# Altium schematic sheet BMS_Monitor.SchDoc
size A0; SheetNumber: 1; SheetTotal: 1
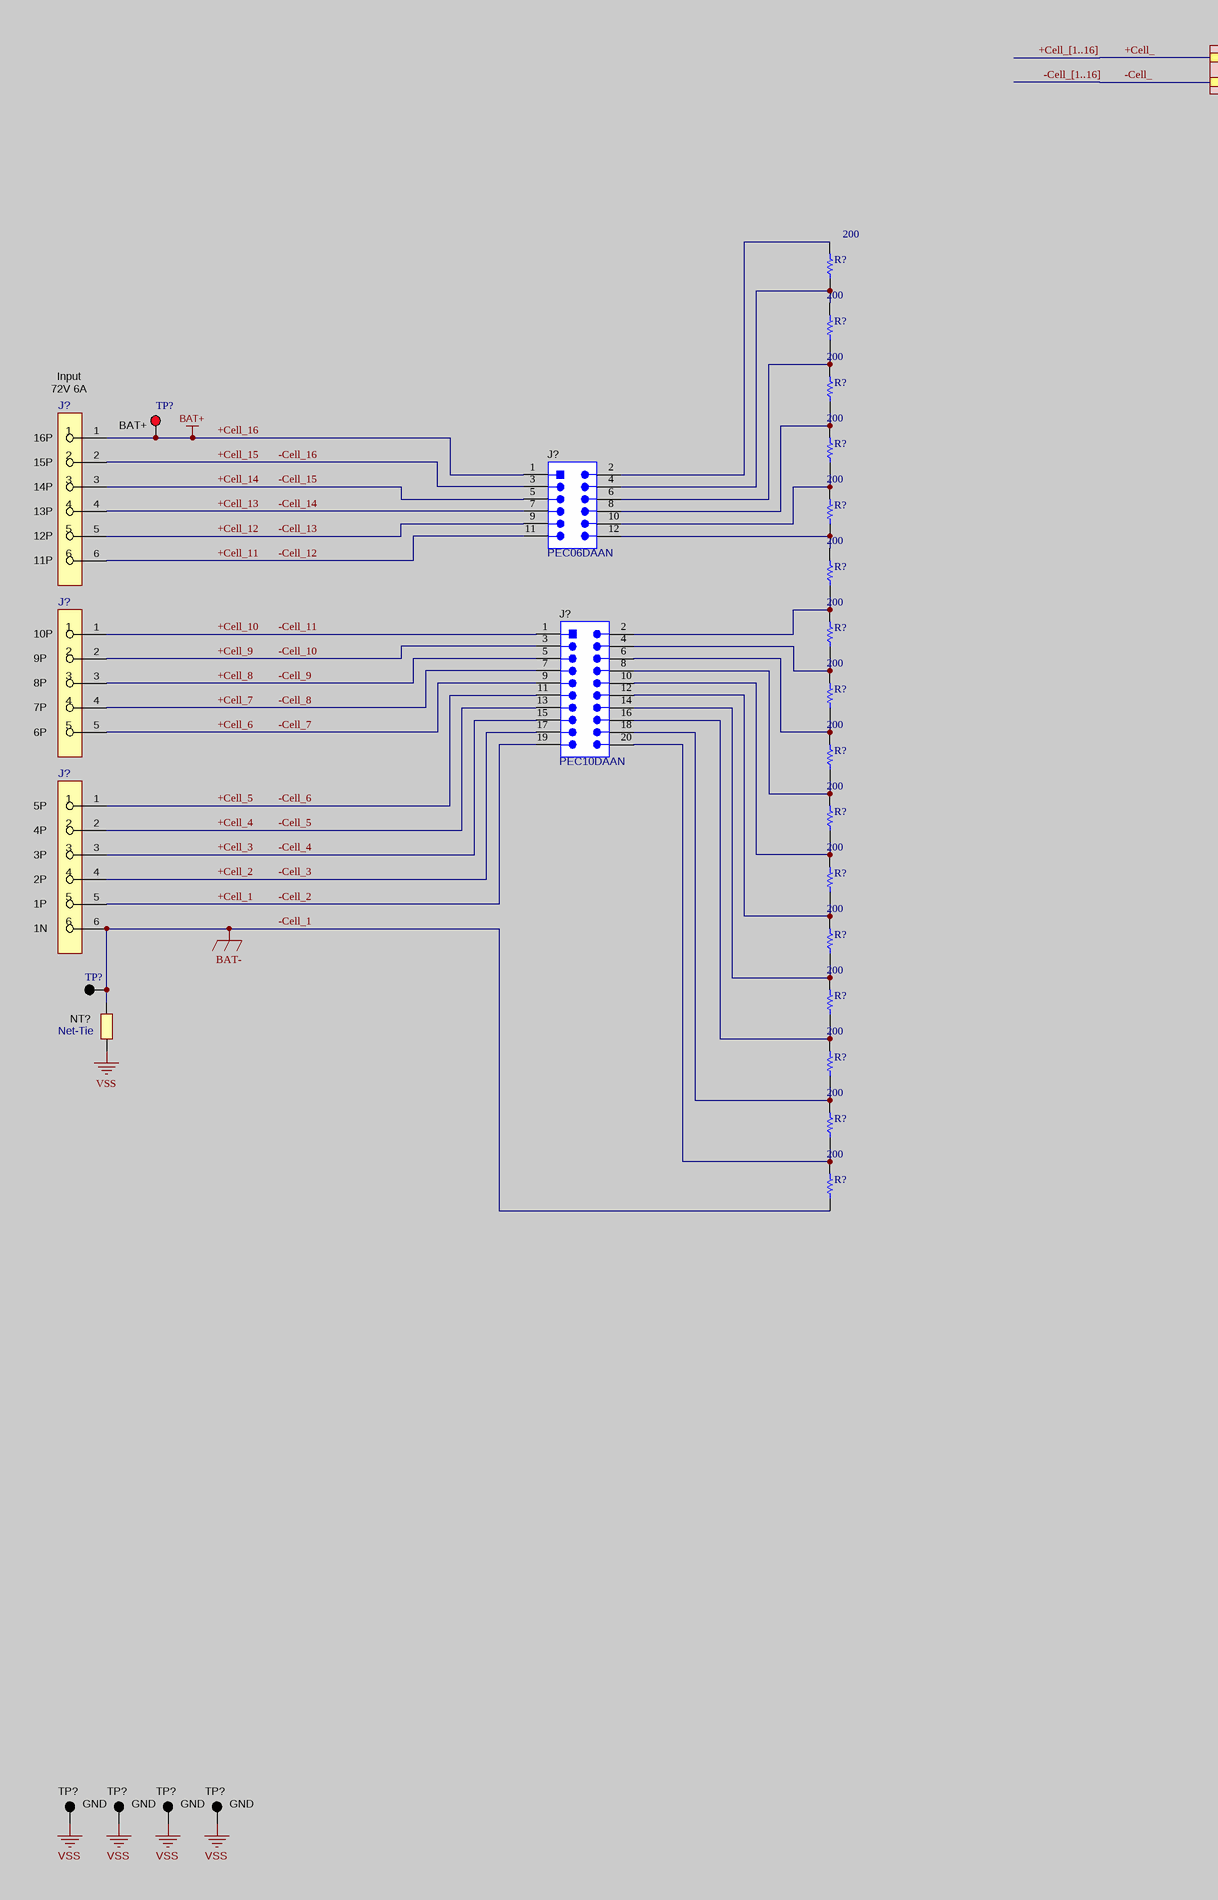
[diagram p0: BMS_Monitor.SchDoc, left]
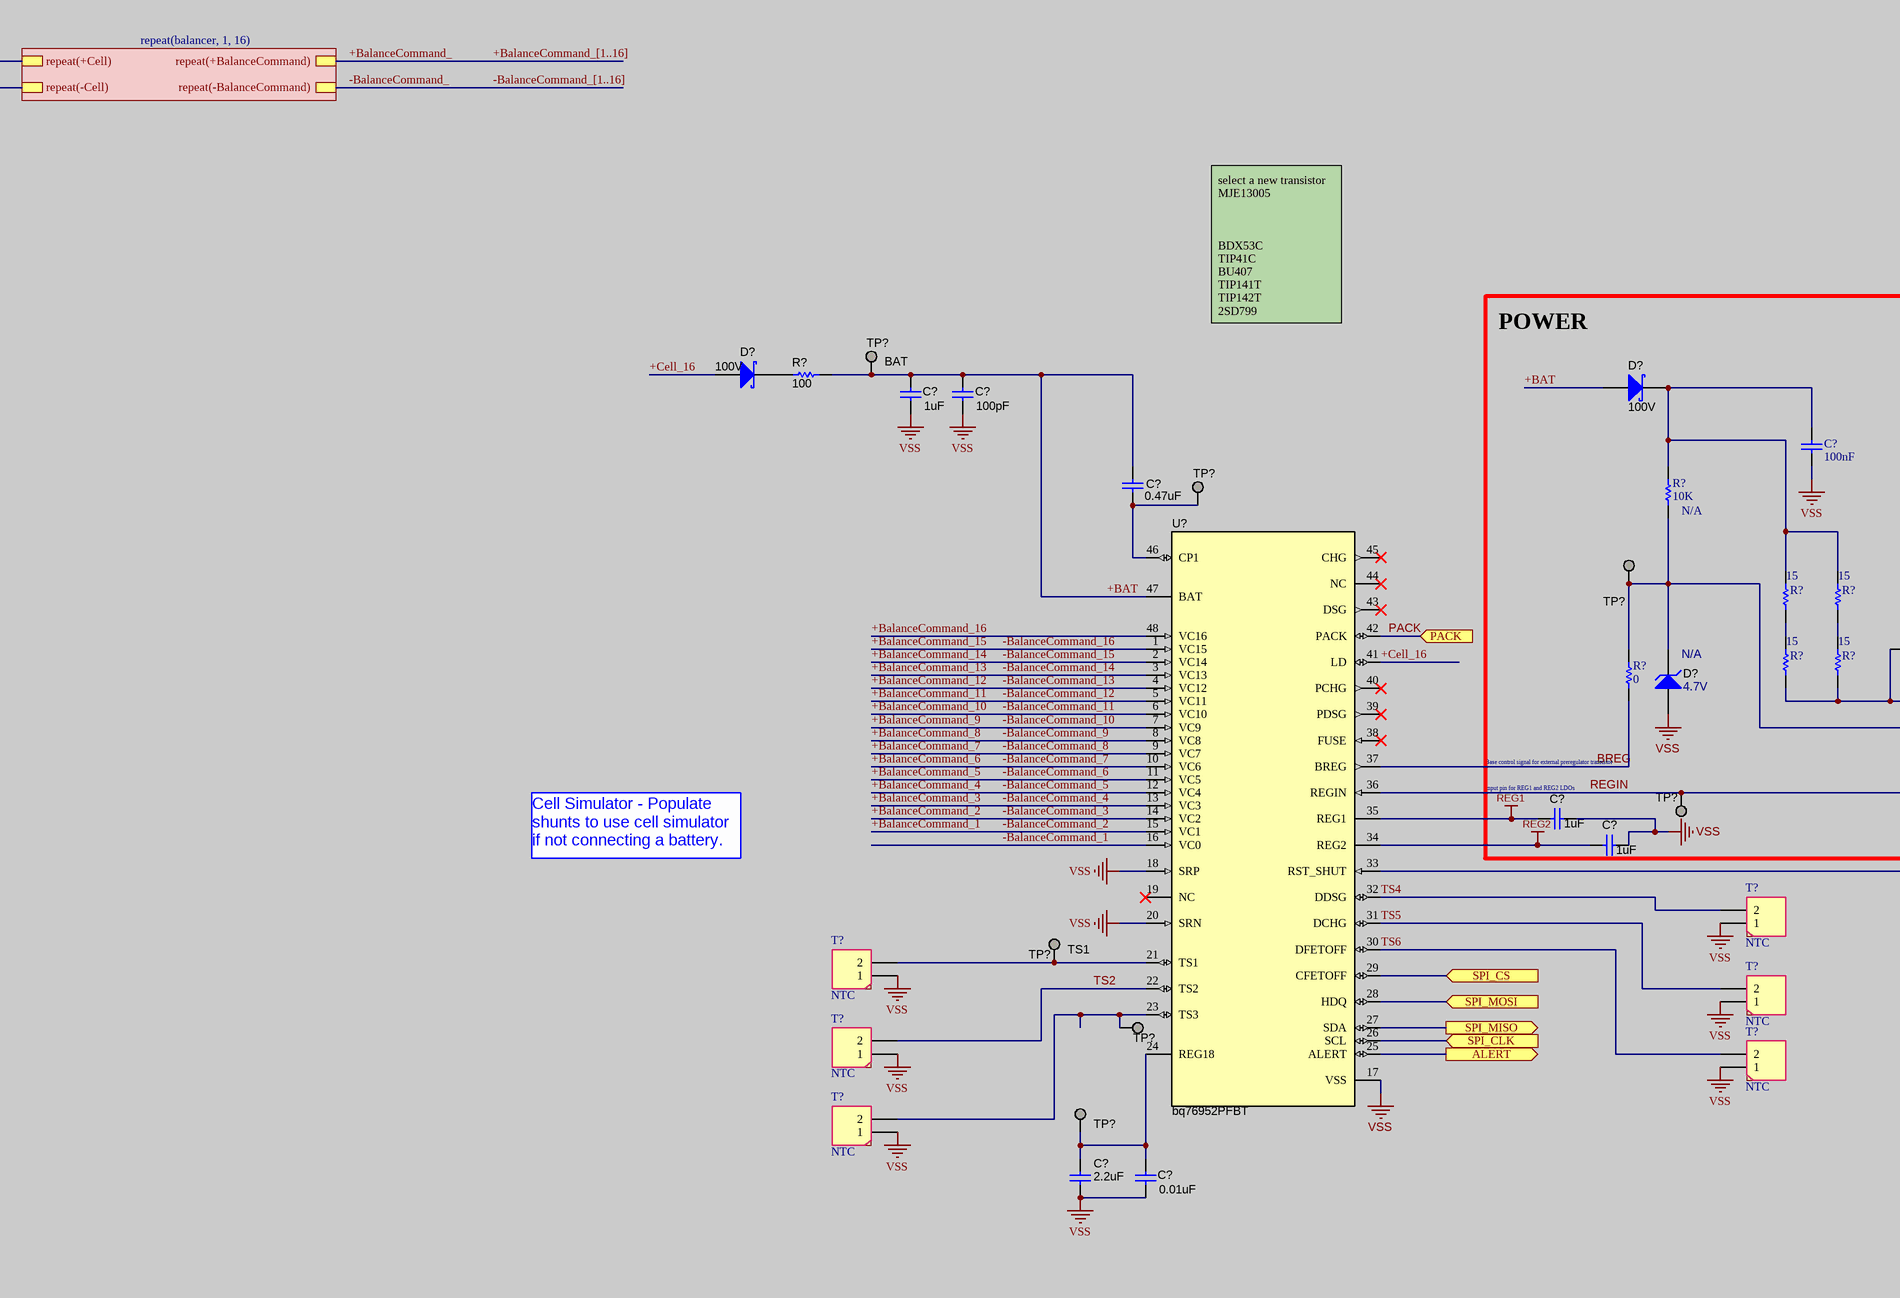
[diagram p1: BMS_Monitor.SchDoc, middle]
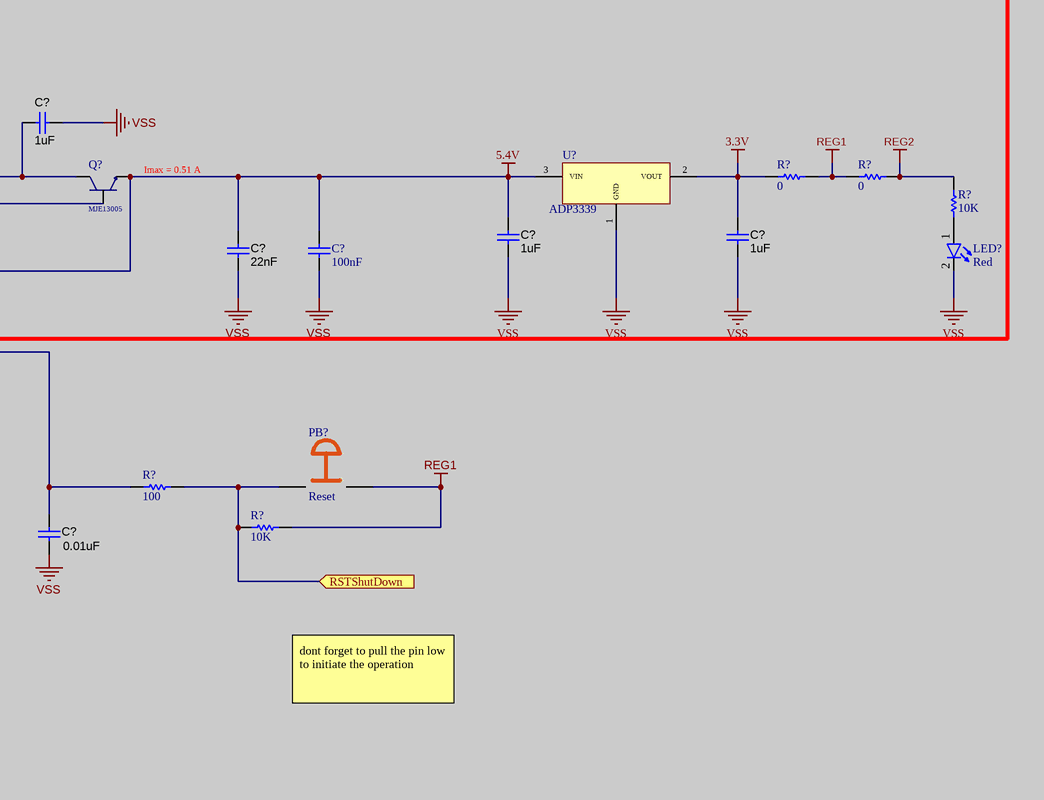
[diagram p2: BMS_Monitor.SchDoc, right]

## Parts
(Parts that share a designator on the sheet are numbered #1, #2 ... from top to bottom, then left to right.)
C?#1  ValueDisplayed: 1uF  [1206_180]  (hidden comment: C3216X7R2A105K160AA)
C?#2  ValueDisplayed: 100pF  [0603]  (hidden comment: GCM1885C2A101JA16D)
C?#3  100nF  [CAPC0603]
C?#4  ValueDisplayed: 0.47uF  [0805_HV]  (hidden comment: GCM219R71E474KA55D)
C?#5  ValueDisplayed: 1uF  [1206_180]  (hidden comment: C3216X7R2A105K160AA)
C?#6  ValueDisplayed: 1uF  [0805_HV]  (hidden comment: EMK212B7105KG-T)
C?#7  ValueDisplayed: 1uF  [0805_HV]  (hidden comment: EMK212B7105KG-T)
C?#8  Cap_F: 22nF  [0603]  (hidden comment: C0603C223K4RACTU)
C?#9  100nF  [CAPC0603]
C?#10  ValueDisplayed: 1uF  [0805_HV]  (hidden comment: EMK212B7105KG-T)
C?#11  ValueDisplayed: 1uF  [0805_HV]  (hidden comment: EMK212B7105KG-T)
C?#12  ValueDisplayed: 0.01uF  [0603]  (hidden comment: 885012206040)
C?#13  ValueDisplayed: 2.2uF  [0805_HV]  (hidden comment: EMK212B7225KG-T)
C?#14  ValueDisplayed: 0.01uF  [0603]  (hidden comment: 885012206040)
D?#1  value 100V  [SOD-123]  (hidden comment: BAT46W-7-F)
D?#2  value 100V  [SOD-123]  (hidden comment: BAT46W-7-F)
D?#3  N/A  value 4.7V  [ZENER]
J?#1  OSTTE060161  [FP-OSTTE060161_HDR6-MFG]  (value not drawn)
J?#2  PEC06DAAN  [CONN_PEC06DAAN]
J?#3  OSTTE050161  [FP-OSTTE050161_HDR5-MFG]  (value not drawn)
J?#4  PEC10DAAN  [SULLINS_PEC10DAAN]
J?#5  OSTTE060161  [FP-OSTTE060161_HDR6-MFG]  (value not drawn)
LED?  Red  [LED SMD 1206]
NT?  Net-Tie  [Net-Tie_10milWide_30milLong]  (net tie, no BOM)
PB?  Reset  [SWITCH-PB4]
Q?  Transistor: MJE13005  [dpak]  (hidden comment: NPN transistor)
R?#1  200  [RESC0603]
R?#2  200  [RESC0603]
R?#3  ValueDisplayed: 100  [0603]  (hidden comment: Resistor)
R?#4  200  [RESC0603]
R?#5  200  [RESC0603]
R?#6  N/A  value 10K  [RES0603]
R?#7  200  [RESC0603]
R?#8  15  [RES2512]
R?#9  15  [RESC0603]
R?#10  200  [RESC0603]
R?#11  0  [RES0603]
R?#12  15  [RESC0603]
R?#13  15  [RESC0603]
R?#14  200  [RESC0603]
R?#15  0  [RES0603]
R?#16  0  [RES0603]
R?#17  10K  [RES0603]
R?#18  200  [RESC0603]
R?#19  200  [RESC0603]
R?#20  200  [RESC0603]
R?#21  200  [RESC0603]
R?#22  100  [RES0603]
R?#23  200  [RESC0603]
R?#24  10K  [RES0603]
R?#25  200  [RESC0603]
R?#26  200  [RESC0603]
R?#27  200  [RESC0603]
R?#28  200  [RESC0603]
T?#1  NTC  [HEADER1*2]
T?#2  NTC  [HEADER1*2]
T?#3  NTC  [HEADER1*2]
T?#4  NTC  [HEADER1*2]
T?#5  NTC  [HEADER1*2]
T?#6  NTC  [HEADER1*2]
TP?#1  TESTPOINT  [TP_VIA_060RND040]  (value not drawn)  (no BOM)
TP?#2  TESTPOINT  [Keystone5010]  (value not drawn)
TP?#3  TESTPOINT  [TP_VIA_060RND040]  (value not drawn)  (no BOM)
TP?#4  TESTPOINT  [TP_VIA_060RND040]  (value not drawn)  (no BOM)
TP?#5  TESTPOINT  [TP_VIA_060RND040]  (value not drawn)  (no BOM)
TP?#6  TESTPOINT  [TP_VIA_060RND040]  (value not drawn)  (no BOM)
TP?#7  TESTPOINT  [TP_VIA_060RND040]  (value not drawn)  (no BOM)
TP?#8  TESTPOINT  [Keystone5011]  (value not drawn)
TP?#9  TESTPOINT  [TP_50MIL-25MILHOLE]  (value not drawn)  (no BOM)
TP?#10  5006  [Keystone5006]  (value not drawn)
TP?#11  5006  [Keystone5006]  (value not drawn)
TP?#12  5006  [Keystone5006]  (value not drawn)
TP?#13  5006  [Keystone5006]  (value not drawn)
U?#1  ADP3339  [AMS1117]
U?#2  bq76952PFBT  [PFB0048A_N]

## Blocks framed on the sheet
POWER: C?#3 C?#5-C?#11 D?#2 D?#3 LED? Q? R?#6 R?#8 R?#9 R?#11-R?#13 R?#15-R?#17 TP?#4 TP?#5 U?#1

## Sub-sheets
repeat(balancer, 1, 16) = balancer.SchDoc: repeat(+Cell), repeat(+BalanceCommand), repeat(-Cell), repeat(-BalanceCommand)

## Ports
ALERT (out), PACK (in), RSTShutDown (in), SPI_CLK (in), SPI_CS (in), SPI_MISO (out), SPI_MOSI (in)

## Nets
3.3V: C?#7.2 R?#15.1 U?#1.2(VOUT)
+Cell_16: D?#1.2(A) J?#1.1 J?#2.1 TP?#2.1 U?#2.41(LD)  [also labelled BAT+]
-Cell_1: J?#5.6 NT?.2 R?#28.1 TP?#8.1  [also labelled BAT-]
REG1: C?#10.2 PB?.2 R?#15.2 R?#16.1 R?#24.2 U?#2.35(REG1)
REG2: C?#11.2 R?#16.2 R?#17.1 U?#2.34(REG2)
REGIN: C?#6.2 C?#8.2 C?#9.2 Q?.2(E) TP?#5.1 U?#1.3(VIN) U?#2.36(REGIN)  [also labelled 5.4V]
VSS: C?#1.2 C?#2.2 C?#3.1 C?#5.2 C?#6.1 C?#7.1 C?#8.1 C?#9.1 C?#10.1 C?#11.1 C?#12.2 C?#13.1 C?#14.2 D?#3.2(A) LED?.2(K) NT?.1 T?#1.1 T?#2.1 T?#3.1 T?#4.1 T?#5.1 T?#6.1 TP?#10.1 TP?#11.1 TP?#12.1 TP?#13.1 U?#1.1(GND) U?#2.17(VSS) U?#2.18(SRP) U?#2.20(SRN)
+BalanceCommand_: sheet repeat(balancer, 1, 16)/repeat(+BalanceCommand)
+BalanceCommand_1: U?#2.15(VC1)  [also labelled -BalanceCommand_2]
+BalanceCommand_2: U?#2.14(VC2)  [also labelled -BalanceCommand_3]
+BalanceCommand_3: U?#2.13(VC3)  [also labelled -BalanceCommand_4]
+BalanceCommand_4: U?#2.12(VC4)  [also labelled -BalanceCommand_5]
+BalanceCommand_5: U?#2.11(VC5)  [also labelled -BalanceCommand_6]
+BalanceCommand_6: U?#2.10(VC6)  [also labelled -BalanceCommand_7]
+BalanceCommand_7: U?#2.9(VC7)  [also labelled -BalanceCommand_8]
+BalanceCommand_8: U?#2.8(VC8)  [also labelled -BalanceCommand_9]
+BalanceCommand_9: U?#2.7(VC9)  [also labelled -BalanceCommand_10]
+BalanceCommand_10: U?#2.6(VC10)  [also labelled -BalanceCommand_11]
+BalanceCommand_11: U?#2.5(VC11)  [also labelled -BalanceCommand_12]
+BalanceCommand_12: U?#2.4(VC12)  [also labelled -BalanceCommand_13]
+BalanceCommand_13: U?#2.3(VC13)  [also labelled -BalanceCommand_14]
+BalanceCommand_14: U?#2.2(VC14)  [also labelled -BalanceCommand_15]
+BalanceCommand_15: U?#2.1(VC15)  [also labelled -BalanceCommand_16]
+BalanceCommand_16: U?#2.48(VC16)
+BAT: C?#1.1 C?#2.1 C?#4.1 D?#2.2(A) R?#3.1 TP?#1.1 U?#2.47(BAT)
+Cell_: sheet repeat(balancer, 1, 16)/repeat(+Cell)
+Cell_1: J?#4.19 J?#5.5  [also labelled -Cell_2]
+Cell_2: J?#4.17 J?#5.4  [also labelled -Cell_3]
+Cell_3: J?#4.15 J?#5.3  [also labelled -Cell_4]
+Cell_4: J?#4.13 J?#5.2  [also labelled -Cell_5]
+Cell_5: J?#4.11 J?#5.1  [also labelled -Cell_6]
+Cell_6: J?#3.5 J?#4.9  [also labelled -Cell_7]
+Cell_7: J?#3.4 J?#4.7  [also labelled -Cell_8]
+Cell_8: J?#3.3 J?#4.5  [also labelled -Cell_9]
+Cell_9: J?#3.2 J?#4.3  [also labelled -Cell_10]
+Cell_10: J?#3.1 J?#4.1  [also labelled -Cell_11]
+Cell_11: J?#1.6 J?#2.11  [also labelled -Cell_12]
+Cell_12: J?#1.5 J?#2.9  [also labelled -Cell_13]
+Cell_13: J?#1.4 J?#2.7  [also labelled -Cell_14]
+Cell_14: J?#1.3 J?#2.5  [also labelled -Cell_15]
+Cell_15: J?#1.2 J?#2.3  [also labelled -Cell_16]
-BalanceCommand_: sheet repeat(balancer, 1, 16)/repeat(-BalanceCommand)
-BalanceCommand_1: U?#2.16(VC0)
-Cell_: sheet repeat(balancer, 1, 16)/repeat(-Cell)
ALERT: U?#2.25(ALERT) ; port ALERT
BREG: R?#11.2 U?#2.37(BREG)
PACK: U?#2.42(PACK) ; port PACK
RSTShutDown: PB?.1 R?#22.2 R?#24.1 ; port RSTShutDown
SPI_CLK: U?#2.26(SCL) ; port SPI_CLK
SPI_CS: U?#2.29(CFETOFF) ; port SPI_CS
SPI_MISO: U?#2.27(SDA) ; port SPI_MISO
SPI_MOSI: U?#2.28(HDQ) ; port SPI_MOSI
TS2: T?#4.2 U?#2.22(TS2)
TS4: T?#1.2 U?#2.32(DDSG)
TS5: T?#3.2 U?#2.31(DCHG)
TS6: T?#5.2 U?#2.30(DFETOFF)
NetC?#3_2: C?#3.2 D?#2.1(K) R?#6.1 R?#8.2 R?#9.2
NetC?#4_2: C?#4.2 TP?#3.1 U?#2.46(CP1)
NetC?#5_1: C?#5.1 Q?.3(C) R?#12.1 R?#13.1
NetC?#12_1: C?#12.1 R?#22.1 U?#2.33(RST_SHUT)
NetC?#13_2: C?#13.2 C?#14.1 TP?#9.1 U?#2.24(REG18)
NetD?#1_1: D?#1.1(K) R?#3.2
NetD?#3_1: D?#3.1(K) Q?.1(B) R?#6.2 R?#11.1 TP?#4.1
NetJ?#2_2: J?#2.2 R?#1.2
NetJ?#2_4: J?#2.4 R?#1.1 R?#2.2
NetJ?#2_6: J?#2.6 R?#2.1 R?#4.2
NetJ?#2_8: J?#2.8 R?#4.1 R?#5.2
NetJ?#2_10: J?#2.10 R?#5.1 R?#7.2
NetJ?#2_12: J?#2.12 R?#7.1 R?#10.2
NetJ?#4_2: J?#4.2 R?#10.1 R?#14.2
NetJ?#4_4: J?#4.4 R?#14.1 R?#18.2
NetJ?#4_6: J?#4.6 R?#18.1 R?#19.2
NetJ?#4_8: J?#4.8 R?#19.1 R?#20.2
NetJ?#4_10: J?#4.10 R?#20.1 R?#21.2
NetJ?#4_12: J?#4.12 R?#21.1 R?#23.2
NetJ?#4_14: J?#4.14 R?#23.1 R?#25.2
NetJ?#4_16: J?#4.16 R?#25.1 R?#26.2
NetJ?#4_18: J?#4.18 R?#26.1 R?#27.2
NetJ?#4_20: J?#4.20 R?#27.1 R?#28.2
NetLED?_1: LED?.1(A) R?#17.2
NetR?#8_1: R?#8.1 R?#12.2
NetR?#9_1: R?#9.1 R?#13.2
NetT?#2_2: T?#2.2 TP?#6.1 U?#2.21(TS1)
NetT?#6_2: T?#6.2 TP?#7.1 U?#2.23(TS3)

Not connected (* = marked no-connect by the designer): U?#2 19(NC)* 38(FUSE)* 39(PDSG)* 40(PCHG)* 43(DSG)* 44(NC)* 45(CHG)*

## Buses and harness runs
bus +BalanceCommand_[1..16]
bus +Cell_[1..16]
bus -BalanceCommand_[1..16]
bus -Cell_[1..16]

## Notes on the sheet
- BAT
- select a new transistor
  MJE13005
  BDX53C
  TIP41C
  BU407
  TIP141T
  TIP142T
  2SD799
- Input
- (near J?#1) 72V 6A
- (near J?#1) 15P
- (near J?#1) 16P
- (near TP?#2) BAT+
- (near J?#1) 13P
- (near J?#1) 12P
- (near J?#1) 14P
- (near J?#1) 11P
- (near J?#3) 9P
- (near J?#3) 10P
- (near Q?) Imax = 0.51 A
- (near J?#3) 7P
- (near J?#3) 8P
- Base control signal for external preregulator transistor
- (near J?#3) 6P
- (near C?#10) Input pin for REG1 and REG2 LDOs
- (near J?#5) 4P
- (near J?#5) 5P
- Cell Simulator - Populate shunts to use cell simulator if not connecting a battery.
- (near J?#5) 2P
- (near J?#5) 1P
- (near J?#5) 3P
- (near TP?#6) TS1
- (near J?#5) 1N
- dont forget to pull the pin low to initiate the operation
- (near TP?#10) GND
- (near TP?#11) GND
- (near TP?#12) GND
- (near TP?#13) GND

## Library data of the parts
C?#1 C?#5 = CMP-0008710-2: CAP, CERM, 1 uF, 100 V, +/- 10%, X7R, 1206; Manufacturer: TDK; TaMin_C: -55°C; ESR_ohm: 4.575m; Polarized: N; SizeAreaWB_mm2: 10.92; Value1: 0.004575 ohm; U/M: EA; Value: 1uF; TaMax_C: 125°C; SizeZ_mm: 1.8; SizeX_mm: 3.2; SizeY_mm: 1.6; Value2: 100V; SizeArea_mm2: 5.12; Cap_F: 1µF; IRMS_A: 3.39639A; AEC Category: Q200; Supplier Part Number 2: 810-C3216X7R2A105K160AA; Publisher: Texas Instruments; Supplier 2: Mouser; TempCo: X7R; Published: 2008-06-19; RoHS: Y; MountType: SMT; Supplier 1: Digi-Key; PackageReference: 1206; Tolerance_%: 10%; Cap_Case: 1206_180; CompType: Capacitor; LatestRevisionDate: 2017-03-09; PartNumber: C3216X7R2A105K160AA; AEC Qualified: N; VDC_V: 100V; ComponentLink1Description: Datasheet link; AEC Grade: N/A; Supplier Part Number 1: 445-4467-1-ND; Technology: Ceramic; ComponentLink1URL: https://product.tdk.com/en/search/capacitor/ceramic/mlcc/info?part_no=C3216X7R2A105K160AA
C?#2 = CMP-0007130-4: CAP, CERM, 100 pF, 100 V, +/- 5%, C0G/NP0, AEC-Q200 Grade 1, 0603; Manufacturer: MuRata; TaMin_C: -55°C; Polarized: N; SizeAreaWB_mm2: 4.68; Value1: Unknown; U/M: EA; TaMax_C: 125°C; SizeZ_mm: 1; SizeX_mm: 1.6; SizeY_mm: 0.8; Value2: 100V; SizeArea_mm2: 1.28; AEC Qualified: Y; AEC Category: Q200; Value: 100pF; Supplier Part Number 2: 81-GCM1885C2A101JA6D; Publisher: Texas Instruments; Supplier 2: Mouser; TempCo: C0G/NP0; Published: 2008-06-19; RoHS: Y; MountType: SMT; Supplier 1: Digi-Key; PackageReference: 0603; Tolerance_%: 5%; Cap_Case: 0603; CompType: Capacitor; LatestRevisionDate: 2017-03-09; PartNumber: GCM1885C2A101JA16D; Cap_F: 100pF; VDC_V: 100V; ComponentLink1Description: Datasheet link; AEC Grade: 1; Supplier Part Number 1: 490-4771-1-ND; Technology: Ceramic; ComponentLink1URL: http://psearch.murata.com/capacitor/product/GCM1885C2A101JA16%23.pdf
C?#3 C?#9 = Capacitor: Published: 8-Jun-2000; LatestRevisionDate: 17-Jul-2002; LatestRevisionNote: Re-released for DXP Platform.; PackageReference: C0805; Publisher: Altium Limited; Value: 100nF
C?#4 = CMP-0008010-2: CAP, CERM, 0.47 uF, 25 V, +/- 10%, X7R, AEC-Q200 Grade 1, 0805; Manufacturer: MuRata; TaMin_C: -55°C; Polarized: N; SizeAreaWB_mm2: 6.75; Value1: Unknown; U/M: EA; Value: 0.47uF; TaMax_C: 125°C; SizeZ_mm: 1.45; SizeX_mm: 2; SizeY_mm: 1.25; Cap_Case: 0805; Value2: 25V; SizeArea_mm2: 2.5; AEC Qualified: Y; Cap_F: 470nF; AEC Grade: 1; AEC Category: Q200; Supplier Part Number 2: 81-GCM219R71E474KA5D; Publisher: Texas Instruments; Supplier 2: Mouser; TempCo: X7R; Published: 2008-06-19; RoHS: Y; MountType: SMT; Supplier 1: Digi-Key; PackageReference: 0805; Tolerance_%: 10%; CompType: Capacitor; LatestRevisionDate: 2017-03-09; PartNumber: GCM219R71E474KA55D; VDC_V: 25V; ComponentLink1Description: Datasheet link; Supplier Part Number 1: 490-8044-1-ND; Technology: Ceramic; ComponentLink1URL: http://psearch.murata.com/capacitor/product/GCM219R71E474KA55%23.pdf
C?#6 C?#7 C?#10 C?#11 = CMP-0008000-2: CAP, CERM, 1 uF, 16 V, +/- 10%, X7R, 0805; Manufacturer: Taiyo Yuden; TaMin_C: -55°C; Polarized: N; SizeAreaWB_mm2: 6.75; Value1: Unknown; U/M: EA; Value: 1uF; TaMax_C: 125°C; SizeZ_mm: 1.45; SizeX_mm: 2; SizeY_mm: 1.25; Cap_Case: 0805; Value2: 16V; SizeArea_mm2: 2.5; Cap_F: 1µF; AEC Category: Q200; Supplier Part Number 2: 1683653; Publisher: Texas Instruments; Supplier 2: Farnell; TempCo: X7R; Published: 2008-06-19; RoHS: Y; MountType: SMT; Supplier 1: Digi-Key; PackageReference: 0805; Tolerance_%: 10%; CompType: Capacitor; LatestRevisionDate: 2017-03-09; PartNumber: EMK212B7105KG-T; AEC Qualified: ?; VDC_V: 16V; ComponentLink1Description: Datasheet link; Supplier Part Number 1: 587-1283-1-ND; Technology: Ceramic; ComponentLink1URL: http://www.yuden.co.jp/ut/product/pdf/djmk_e.pdf
C?#8 = CMP-0006900-4: CAP, CERM, 0.022 uF, 16 V, +/- 10%, X7R, 0603; Manufacturer: Kemet; TaMin_C: -55°C; Polarized: N; SizeAreaWB_mm2: 4.68; Value1: Unknown; U/M: EA; TaMax_C: 125°C; SizeZ_mm: 1; SizeX_mm: 1.6; SizeY_mm: 0.8; Value2: 16V; SizeArea_mm2: 1.28; AEC Category: Q200; Supplier Part Number 2: 80-C0603C223K4R; Publisher: Texas Instruments; Supplier 2: Mouser; TempCo: X7R; Published: 2008-06-19; RoHS: Y; MountType: SMT; Value: 0.022uF; Supplier 1: Digi-Key; PackageReference: 0603; Tolerance_%: 10%; Cap_Case: 0603; CompType: Capacitor; LatestRevisionDate: 2017-03-09; PartNumber: C0603C223K4RACTU; AEC Qualified: ?; VDC_V: 16V; ComponentLink1Description: Datasheet link; Supplier Part Number 1: 399-1093-1-ND; Technology: Ceramic; ValueDisplayed: 0.022uF; ComponentLink1URL: http://www.kemet.com/kemet/web/homepage/kechome.nsf/vapubfiles/F3102_Y5V.pdf/$file/F3102_Y5V.pdf; Supplier 3: Farnell; Supplier Part Number 3: 1204523
C?#12 C?#14 = CMP-0006828-4: CAP, CERM, 0.01 uF, 16 V, +/- 10%, X7R, 0603; Manufacturer: Wurth Elektronik; TaMin_C: -55°C; Polarized: N; SizeAreaWB_mm2: 4.68; Value1: Unknown; U/M: EA; Value: 0.01uF; TaMax_C: 125°C; SizeZ_mm: 1; SizeX_mm: 1.6; SizeY_mm: 0.8; Value2: 16V; SizeArea_mm2: 1.28; Cap_F: 10nF; AEC Category: Q200; Supplier Part Number 2: 710-885012206040; Publisher: Texas Instruments; Supplier 2: Mouser; TempCo: X7R; Published: 2008-06-19; RoHS: Y; MountType: SMT; Supplier 1: Digi-Key; PackageReference: 0603; Tolerance_%: 10%; Cap_Case: 0603; CompType: Capacitor; LatestRevisionDate: 2017-03-09; PartNumber: 885012206040; AEC Qualified: N; VDC_V: 16V; ComponentLink1Description: Datasheet link; AEC Grade: N/A; Supplier Part Number 1: 732-7959-1-ND; Technology: Ceramic; ComponentLink1URL: http://katalog.we-online.de/pbs/datasheet/885012206040.pdf
C?#13 = CMP-0008001-2: CAP, CERM, 2.2 uF, 16 V, +/- 10%, X7R, 0805; Manufacturer: Taiyo Yuden; TaMin_C: -55°C; Polarized: N; SizeAreaWB_mm2: 6.75; Value1: Unknown; U/M: EA; Value: 2.2uF; TaMax_C: 125°C; SizeZ_mm: 1.45; SizeX_mm: 2; SizeY_mm: 1.25; Cap_Case: 0805; Value2: 16V; SizeArea_mm2: 2.5; Cap_F: 2.2µF; AEC Category: Q200; Supplier Part Number 2: 1683654; Publisher: Texas Instruments; Supplier 2: Farnell; TempCo: X7R; Published: 2008-06-19; RoHS: Y; MountType: SMT; Supplier 1: Digi-Key; PackageReference: 0805; Tolerance_%: 10%; CompType: Capacitor; LatestRevisionDate: 2017-03-09; PartNumber: EMK212B7225KG-T; AEC Qualified: ?; VDC_V: 16V; ComponentLink1Description: Datasheet link; Supplier Part Number 1: 587-1431-1-ND; Technology: Ceramic; ComponentLink1URL: http://www.yuden.co.jp/ut/product/pdf/djmk_e.pdf
D?#1 D?#2 = CMP-0028450-2: Diode, Schottky, 100 V, 0.15 A, SOD-123; Manufacturer: Diodes Inc.; Io_A: 150mA; SizeArea_mm2: 6.545; SizeX_mm: 3.85; Value2: 0.6V; Value1: 0.15A; AEC Category: Q101; SizeZ_mm: 1.35; SizeY_mm: 1.7; Green_Lifecycle: Active; Green_REACh: Passed; SizeAreaWB_mm2: 13.095; Vf_V: 600mV; ComponentLink1Description: Datasheet link; MountType: SMT; ComponentLink1URL: http://www.diodes.com/datasheets/ds30044.pdf; Vr_V: 100V; PartNumber: BAT46W-7-F; Type: Schottky; AEC Qualified: ?; Green_EU RoHS-2: Passed; Green_EU RoHS: Passed; CompType: Diode; RoHS: Y; PackageReference: SOD-123
D?#3 = CMP-0005740-3: Diode, Zener, 4.7 V, 500 mW; Manufacturer: ON Semiconductor; PartNumber: MMSZ4697T1G; SizeY_mm: 1.7; SizeX_mm: 3.85; RJA_CperW: 340; SizeAreaWB_mm2: 13.095; AEC Category: Q101; Power_W: 500mW; SizeZ_mm: 1.35; Vz_V: 10V; Value1: 0.5W; SizeArea_mm2: 6.545; PackageReference: SOD-123; AEC Qualified: ?; MountType: SMT; RoHS: Y; ComponentLink1Description: Datasheet link; CompType: Zener; ComponentLink1URL: http://www.onsemi.com/pub_link/Collateral/MMSZ4678T1-D.PDF
J?#1 J?#5 = CMP-0087050-1: TERM BLOCK 3.5MM VERT 6POS PCB; Manufacturer: On Shore Technology; ContactFinish: Tin; Current_A: 10A; Voltage_V: 300V; Row_Count: 1; PinCount: 6; RoHS: TRUE; ComponentLink1URL: http://www.on-shore.com/wp-content/uploads/2019/02/OSTTEXX0161.pdf; ComponentLink1Description: Datasheet; PartNumber: OSTTE060161; Symbol Name: SYM-OSTTE060161; PackageReference: HDR6
J?#2 = CMP-0054551-2: Header, 100mil, 6x2, Tin, TH; Manufacturer: Sullins Connector Solutions; Current_A: 3A; Green_Lifecycle: Not Set; Shrouded: N; Gender: Male; Green_REACh: Incomplete; Voltage_V: 1.8kV; Row_Count: 2; RowSpacing_mm: 2.54; Cert_UL: Y; ComponentLink1URL: http://www.sullinscorp.com/catalogs/77_PAGE108-109_.100_MALE_HDR.pdf; ClassName: Header; Color: Black; RoHS: Y; MountType: TH; Green_EU RoHS-2: Incomplete; Supplier 1: Digi-Key; Green_EU RoHS: Incomplete; PackageReference: Header, 6x2, 100mil, Tin; PinCount: 12; CompType: Header; PartNumber: PEC06DAAN; Orientation: Vertical; ComponentLink1Description: Datasheet URL; Supplier Part Number 1: S2012E-06-ND; Pitch_mm: 2.54; ContactFinish: Tin
J?#3 = CMP-0087049-1: TERM BLOCK 3.5MM VERT 5POS PCB; Manufacturer: On Shore Technology; Row_Count: 1; ContactFinish: Tin; Current_A: 10A; Voltage_V: 300V; ComponentLink1Description: Datasheet; PinCount: 5; PartNumber: OSTTE050161; RoHS: TRUE; PackageReference: HDR5; Symbol Name: SYM-OSTTE050161; ComponentLink1URL: http://www.on-shore.com/wp-content/uploads/2019/02/OSTTEXX0161.pdf
J?#4 = CMP-0054623-2: Header, 2.54mm, 10x2, Tin, TH; Manufacturer: Sullins Connector Solutions; Current_A: 3A; Green_Lifecycle: Not Set; Shrouded: N; Gender: Male; Green_REACh: Incomplete; Row_Count: 2; RowSpacing_mm: 2.54; Cert_UL: Y; ComponentLink1URL: https://drawings-pdf.s3.amazonaws.com/C10419.pdf; ClassName: Header; Color: Black; RoHS: Y; MountType: TH; Green_EU RoHS-2: Incomplete; Supplier 1: Digi-Key; Green_EU RoHS: Incomplete; PackageReference: Header, 10x2, 2.54mm, TH; PinCount: 20; CompType: Header; PartNumber: PEC10DAAN; Orientation: Vertical; ComponentLink1Description: Datasheet URL; Supplier Part Number 1: S2012E-10-ND; Pitch_mm: 2.54; ContactFinish: Tin
LED? = LED: Designer: Saeid Jorablo; Organazation: ControTec; Adding Date: 1387/12/22; Color: Red; Size: SMD 0603
NT? = CMP-0078142-3: Single point connection between nets.; MountType: SMT; PackageReference: N/A; CompType: Net-Tie; Library Reference: Net-Tie; Manufacturer: N/A; PartNumber: N/A
PB? = Swtich-PB4: 4-Pin Push Button
Q? = BC817: 45 V, 0.5 A
R?#1 R?#2 R?#4 R?#5 R?#7 R?#10 R?#14 R?#18-R?#21 R?#23 R?#25-R?#28 = Resistor: 0603,0.1W; Value: 200; PackageReference: AXIAL-0.5; Published: 8-Jun-2000; LatestRevisionDate: 17-Jul-2002; LatestRevisionNote: Re-released for DXP Platform.; Publisher: Altium Limited
R?#3 = CMP-0025700-4: RES, 100, 5%, 0.1 W, AEC-Q200 Grade 0, 0603; PartNumber: CRCW0603100RJNEA; Manufacturer: Vishay-Dale; Value: 100; Value_Code: 100R; Power_W: 100mW; Value2: 0.1W; VDC_V: 75V; TempCo: 200 ppm/C; EIA_Code: E24; U/M: EA; SizeArea_mm2: 1.28; SizeX_mm: 1.6; SizeY_mm: 0.8; SizeZ_mm: 1; AEC Category: Q200; AEC Qualified: Y; AEC Grade: 0; CompType: Resistor; SymbolVersion: 2009-05-29; PackageReference: 0603; RoHS: E; Res_ohm: 100; Tolerance_%: 5%; Value1: 5%; MountType: SMT; Technology: Thick Film; Published: 2008-06-26; Publisher: Texas Instruments; LatestRevisionDate: 2017-06-13; ComponentLink1Description: Datasheet link; ComponentLink1URL: http://www.vishay.com/docs/20035/dcrcwe3.pdf; Supplier 1: Digi-Key; Supplier Part Number 1: 541-100GCT-ND; Supplier 2: Newark; Supplier Part Number 2: 59M6764; Supplier 3: Mouser; Supplier Part Number 3: 71-CRCW0603J-100-E3
R?#6 R?#11 R?#15-R?#17 R?#22 R?#24 = Res: Resistor; Published: 8-Jun-2000; LatestRevisionDate: 17-Jul-2002; LatestRevisionNote: Re-released for DXP Platform.; PackageReference: AXIAL-0.3; Publisher: Altium Limited; PackageDescription: Axial Device, Thru-Hole; 2 Leads; 0.3 in Pin Spacing
  R?#11 R?#15 R?#16: Value: 0
  R?#17 R?#24: Value: 10K
  R?#22: Value: 100
R?#8 R?#9 R?#12 R?#13 = Resistor_2: 0603,0.1W; Value: 15; PackageReference: AXIAL-0.5; Published: 8-Jun-2000; LatestRevisionDate: 17-Jul-2002; LatestRevisionNote: Re-released for DXP Platform.; Publisher: Altium Limited
T?#1-T?#6 = Header1*2: Header, 2-Pin temperature sensor
TP?#1 TP?#3-TP?#7 TP?#9 = CMP-0078143-2: TEST POINT.  No entry in BOM.; PartNumber: N/A; CompType: Testpoint; Manufacturer: N/A; PackageReference: N/A; Library Reference: TESTPOINT
TP?#2 = CMP-0055147-1: Test Point, Multipurpose, Red, TH; Manufacturer: Keystone; CNHeader: FALSE; Green_Lifecycle: Active; Green_REACh: Passed; ContactFinish: Silver; CT: TRUE; CompType: Test Point; PackageReference: Red Multipurpose Testpoint; PartNumber: 5010; ComponentLink1URL: http://www.keyelco.com/userAssets/file/M60-2p60.pdf; Supplier Part Number 2: 534-5010; Publisher: Texas Instruments; Supplier 2: Mouser; Color: Red; RoHS: Y; MountType: TH; Green_EU RoHS-2: Incomplete; Supplier 1: Digi-Key; Green_EU RoHS: Passed; LatestRevisionDate: 26/05/2017; ComponentLink1Description: Datasheet URL; Supplier Part Number 1: 36-5010-ND
TP?#8 = CMP-0055148-1: Test Point, Multipurpose, Black, TH; Manufacturer: Keystone; CNHeader: FALSE; Green_Lifecycle: Active; Green_REACh: Passed; ContactFinish: Silver; CT: TRUE; CompType: Test Point; PackageReference: Black Multipurpose Testpoint; PartNumber: 5011; ComponentLink1URL: http://www.keyelco.com/userAssets/file/M60-2p60.pdf; Supplier Part Number 2: 534-5011; Publisher: Texas Instruments; Supplier 2: Mouser; Color: Black; RoHS: Y; MountType: TH; Green_EU RoHS-2: Incomplete; Supplier 1: Digi-Key; Green_EU RoHS: Passed; LatestRevisionDate: 26/05/2017; ComponentLink1Description: Datasheet URL; Supplier Part Number 1: 36-5011-ND
TP?#10-TP?#13 = CMP-0055143-1: Test Point, Compact, Black, TH; Manufacturer: Keystone; ContactFinish: Silver; Green_Lifecycle: Active; Green_REACh: Passed; CNHeader: FALSE; CT: TRUE; SymbolVersion: 2008-04-04; PartNumber: 5006; CompType: Test Point; RoHS: Y; PackageReference: Black Compact Testpoint; MountType: TH; ComponentLink1Description: Datasheet URL; ComponentLink1URL: http://www.keyelco.com/userAssets/file/M60-2p60.pdf; Publisher: Texas Instruments; LatestRevisionDate: 26/05/2017; Supplier 1: Digi-Key; Supplier Part Number 1: 36-5006-ND; Supplier 2: Mouser; Supplier Part Number 2: 534-5006; Color: Black; Green_EU RoHS: Passed; Green_EU RoHS-2: Incomplete
U?#1 = AMS1117: High Accuracy, Ultralow IQ, 1.5 A, anyCAP Low Dropout Regulator
U?#2 = CMP-0084229-1: Multicell Battery Monitor and Protection Family, PFB0048A (TQFP-48); Alternate PartNumber: bq76952PFBR; Alternate Manufacturer: Texas Instruments; SizeAreaWB_mm2: 121; SizeZ_mm: 1.2; SizeX_mm: 9; SizeArea_mm2: 81; CompType: IC; AEC Qualified: N; AEC Category: Q200; ComponentLink1URL: http://www.ti.com/lit/ds/symlink/bq76952.pdf; PackageDescription: TQFP-48; MountType: SMT; ComponentLink2URL: http://www.ti.com/product/bq76952; ComponentLink3Description: Online Datasheet; ComponentLink2Description: Product Folder; Manufacturer: Texas Instruments; ComponentLink3URL: http://www.ti.com/product/bq76952/datasheet; PackageReference: PFB0048A; SizeY_mm: 9; PartNumber: bq76952PFBT; ComponentLink1Description: Datasheet Link